# EAGLE design main_scm (EAGLE 9.2.0)
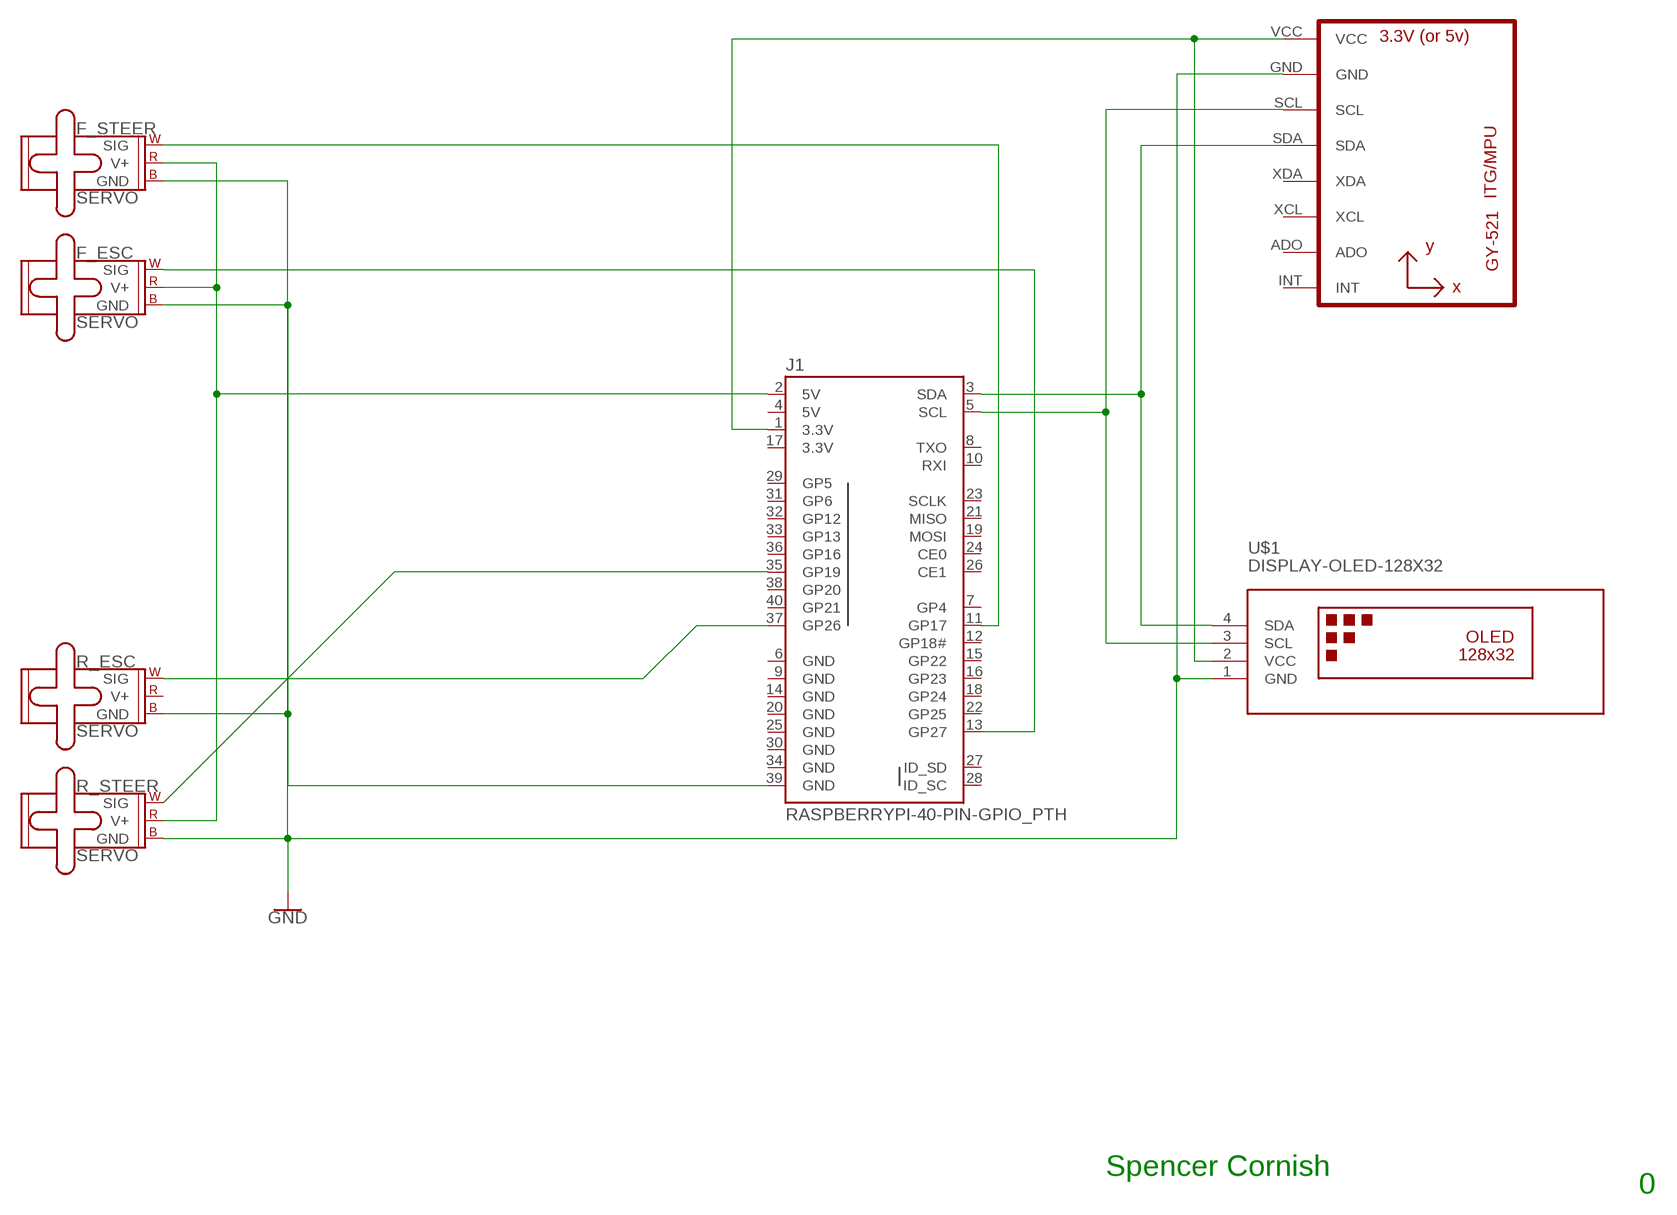
[diagram p0: schematic, sheet 1]

## Parts
F_ESC  SERVO  [1X03]
F_STEER  SERVO  [1X03]
J1  RASPBERRYPI-40-PIN-GPIO_PTH  [2X20_SHROUDED]
R_ESC  SERVO  [1X03]
R_STEER  SERVO  [1X03]
U1  GY-521MPU6050  [GY-521]
U$1  DISPLAY-OLED-128X32  [DISPLAY-OLED-128X32]

## Nets
GND: F_ESC.3(GND) F_STEER.3(GND) J1.39(GND) R_ESC.3(GND) R_STEER.3(GND) U1.GND U$1.1(GND)
N$2: J1.1(3.3V) U1.VCC U$1.2(VCC)
N$3: F_ESC.2(V+) F_STEER.2(V+) J1.2(5V) R_STEER.2(V+)
N$4: J1.3(SDA) U1.SDA U$1.4(SDA)
N$5: J1.5(SCL) U1.SCL U$1.3(SCL)
N$6: J1.35(GP19) R_STEER.1(SIG)
N$7: F_ESC.1(SIG) J1.13(GP27)
N$8: J1.37(GP26) R_ESC.1(SIG)
N$10: F_STEER.1(SIG) J1.11(GP17)
Unconnected: J1.7(GP4) J1.8(TXO) J1.10(RXI) J1.12(GP18#) J1.15(GP22) J1.16(GP23) J1.18(GP24) J1.19(MOSI) J1.21(MISO) J1.22(GP25) J1.23(SCLK) J1.24(CE0) J1.26(CE1) J1.27(ID_SD) J1.28(ID_SC) J1.29(GP5) J1.31(GP6) J1.32(GP12) J1.33(GP13) J1.36(GP16) J1.38(GP20) J1.40(GP21) R_ESC.2(V+) U1.ADO U1.INT U1.XCL U1.XDA

## Notes on the sheet
- Spencer Cornish
- 0

## Power pins joined to a net without a drawn wire
3.3V: J1.17(3.3V)
5V: J1.4(5V)
GND: J1.6(GND) J1.9(GND) J1.14(GND) J1.20(GND) J1.25(GND) J1.30(GND) J1.34(GND)

## Library data of the parts
F_ESC F_STEER R_ESC R_STEER = SparkFun-Electromechanical:SERVO: Servo Motor 3-pin connector for a standard servo motor (voltage supply, ground, and control signal.) SparkFun Products Servo - Generic (Sub-Micro Size) <https://www.sparkfun.com/products/9065> (ROB-09065) Servo - Generic High Torque Continuous Rotation (Standard Size) <https://www.sparkfun.com/products/9347> (ROB-09347) Servo - Generic High Torque (Standard Size) <https://www.sparkfun.com/products/11965> (ROB-11965)
J1 = SparkFun-Connectors:RASPBERRYPI-40-PIN-GPIO: Raspberry Pi GPIO Header 2x20 pin connector, as found on B, B+, A+ models. Both shrouded PTH and SMT versions available. SparkFun Products: GPIO Shrouded Header <https://www.sparkfun.com/products/13054>- PTH SparkFun Pi Wedge (Preassembled) <https://www.sparkfun.com/products/13717>; PROD_ID: CONN-12263; SF_ID: PRT-13054
U1 = gy-521:GY-521
U$1 = diy-modules:DISPLAY-OLED-128X32: 128x32 Dot Matrix OLED Module with I2C interface based on SSD1306 chip More details available here: http://www.tinyosshop.com/index.php?route=product/product&product_id=953 Schematic available here: http://www.tinyosshop.com/datasheet/OLED%2012832.pdf SSD1306 datasheet: https://cdn-shop.adafruit.com/datasheets/SSD1306.pdf Click here to find device on ebay.com <http://www.ebay.com/sch/oled+display+128x32+i2c>

## Board
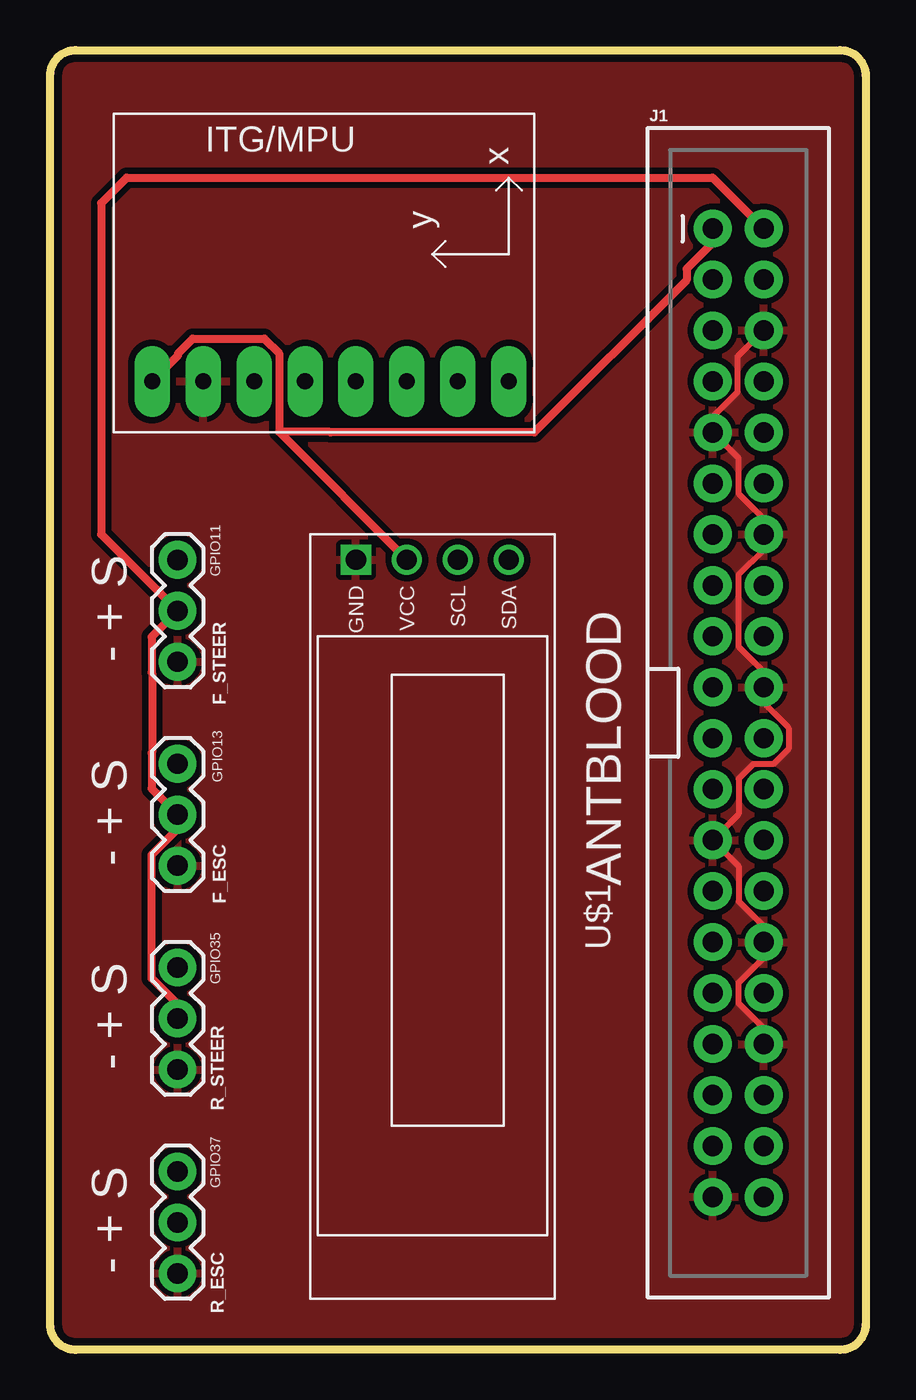
[diagram p1: board, top side]
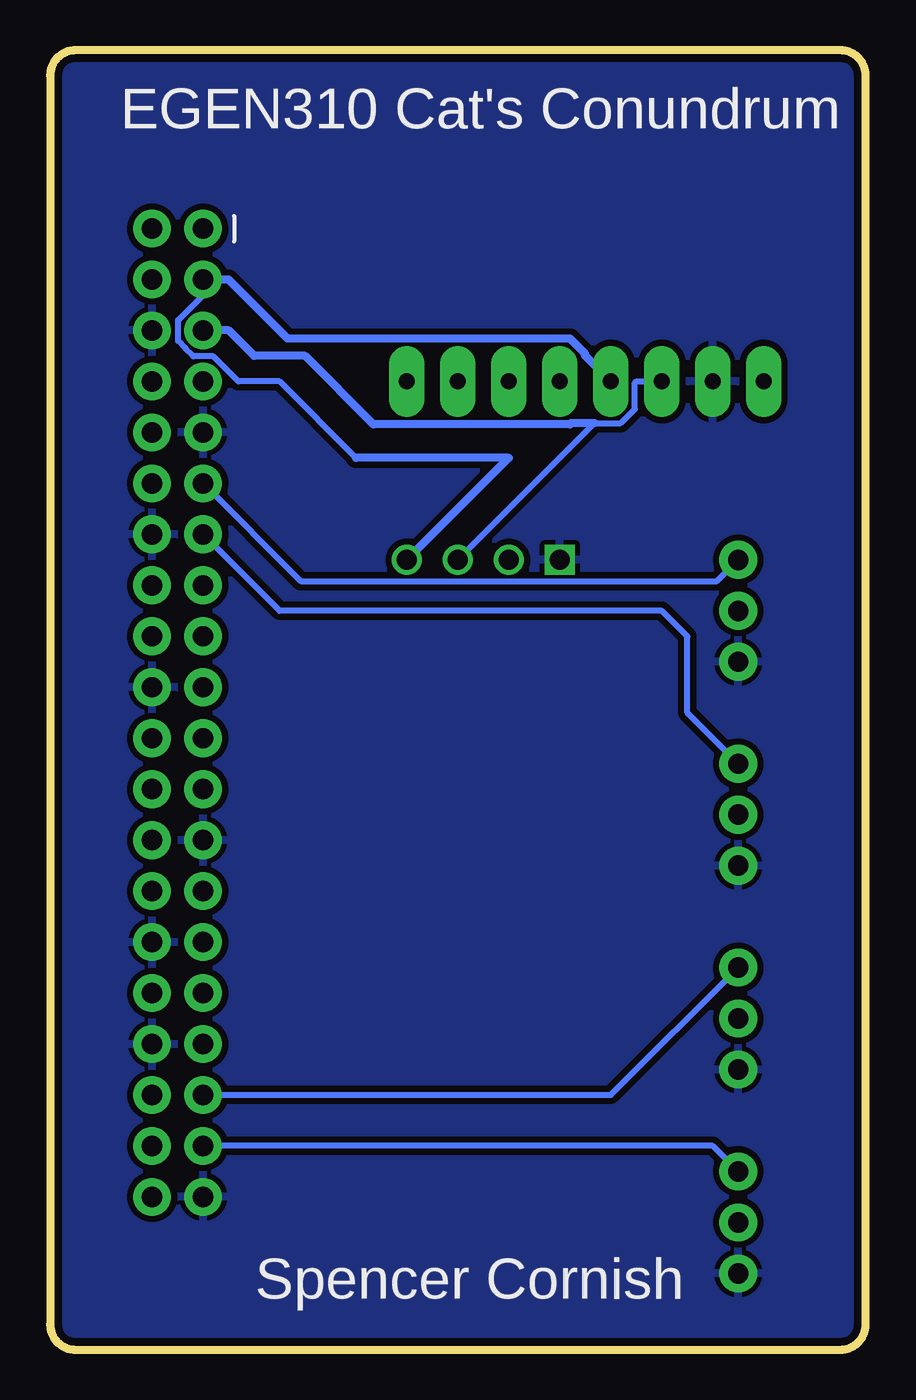
[diagram p2: board, bottom side, seen from below]

Size 40.64 x 64.77 mm. Coordinates in mm from the lower left corner, seen from the top.
Outline: 0,63.5 arc-90 1.27,64.77 39.37,64.77 arc-90 40.64,63.5 40.64,1.27 arc-90 39.37,0 1.27,0 arc-90 0,1.27 0,63.5
Copper layers (1*16): Top 0.035559375mm / dielectric 1.6mm / Bottom 0.035559375mm
Design rules "oshpark-2layer": minimum track width 6mil, minimum drill 10mil, track to track 6mil, track to pad 6mil, pad to pad 6mil, via to via 6mil, smd to smd 6mil, copper to edge 15mil, drill to drill 6mil, minimum pad ring 5mil, minimum via ring 5mil, stop-mask expansion 2.5mil, vias tented up to drill 0mil, thermal gap 10mil

### Footprints (pad centres in the part's own frame; a part is rotated, then mirrored left to right if it is on the bottom)
1X03 = drill 1.016 pad 1.88: 1 0,0; 2 2.54,0; 3 5.08,0
2X20_SHROUDED = drill 1.016 pad 1.88: 1 -1.27,24.13; 2 1.27,24.13; 3 -1.27,21.59; 4 1.27,21.59; 5 -1.27,19.05; 6 1.27,19.05; 7 -1.27,16.51; 8 1.27,16.51; 9 -1.27,13.97; 10 1.27,13.97; 11 -1.27,11.43; 12 1.27,11.43; 13 -1.27,8.89; 14 1.27,8.89; 15 -1.27,6.35; 16 1.27,6.35; 17 -1.27,3.81; 18 1.27,3.81; 19 -1.27,1.27; 20 1.27,1.27; 21 -1.27,-1.27; 22 1.27,-1.27; 23 -1.27,-3.81; 24 1.27,-3.81; 25 -1.27,-6.35; 26 1.27,-6.35; 27 -1.27,-8.89; 28 1.27,-8.89; 29 -1.27,-11.43; 30 1.27,-11.43; 31 -1.27,-13.97; 32 1.27,-13.97; 33 -1.27,-16.51; 34 1.27,-16.51; 35 -1.27,-19.05; 36 1.27,-19.05; 37 -1.27,-21.59; 38 1.27,-21.59; 39 -1.27,-24.13; 40 1.27,-24.13
GY-521 = drill 0.8 pad 1.778 long: ADO -8.89,-6.35; GND -8.89,6.35; INT -8.89,-8.89; SCL -8.89,3.81; SDA -8.89,1.27; VCC -8.89,8.89; XCL -8.89,-3.81; XDA -8.89,-1.27
DISPLAY-OLED-128X32 = drill 1 square: 1 -17.78,-3.81 | drill 1: 2 -17.78,-1.27; 3 -17.78,1.27; 4 -17.78,3.81

### Placement (x,y rotation side)
F_ESC  6.35,29.21 270 top
F_STEER  6.35,39.37 270 top
J1  34.29,31.75 0 top
R_ESC  6.35,8.89 270 top
R_STEER  6.35,19.05 270 top
U1  13.97,57.15 90 top
U$1  19.05,21.59 270 top

### Tracks (layer width: path | path; a pad name or v marks a point on that pad's centre or on a via)
GND
  Top 0.305: J1.34 35.56,16.02 34.32,17.26 34.32,18.3 35.56,19.54 J1.30 35.56,21.1 34.32,22.34 34.32,24.11 J1.25 34.32,26.7 34.32,28.46 35.04,29.19 36.02,29.19 36.8,29.96 36.8,31 35.56,32.24 J1.20 35.56,33.8 34.32,35.04 34.32,38.62 35.56,39.86 J1.14 35.56,41.42 34.32,42.66 34.32,44.42 J1.9 33.02,46.5 34.26,47.74 34.26,49.51 J1.6
  pour Bottom (isolate 0.305): 0,63.5 arc-90 1.27,64.77 39.37,64.77 arc-90 40.64,63.5 40.64,1.27 arc-90 39.37,0 1.27,0 arc-90 0,1.27
  pour Top (isolate 0.305): 0,63.5 arc-90 1.27,64.77 39.37,64.77 arc-90 40.64,63.5 40.64,1.27 arc-90 39.37,0 1.27,0 arc-90 0,1.27
  pour Bottom (isolate 0.305): 0,63.5 arc-90 1.27,64.77 39.37,64.77 arc-90 40.64,63.5 40.64,1.27 arc-90 39.37,0 1.27,0 arc-90 0,1.27
  pour Top (isolate 0.305): 0,63.5 arc-90 1.27,64.77 39.37,64.77 arc-90 40.64,63.5 40.64,1.27 arc-90 39.37,0 1.27,0 arc-90 0,1.27
  pour Top (isolate 0.305): 0,1.27 0,63.5 arc-90 1.27,64.77 39.37,64.77 arc-90 40.64,63.5 40.64,1.27 arc-90 39.37,0 1.27,0 arc-90
N$2
  Top 0.406: U1.VCC 6.38,49.56 6.38,49.67 7.1,50.39 10.68,50.39 11.41,49.67 11.41,45.75 | 11.41,45.75 U$1.2 | J1.1 33.02,55.17 31.73,53.88 31.73,53.31 24.13,45.72 13.97,45.72 13.95,45.75 11.41,45.75
N$3
  Top 0.406: J1.2 33.02,58.42 3.81,58.42 2.54,57.15 2.54,40.64 F_STEER.2 5.05,35.53 5.05,33.75 5.08,33.73 5.08,29.77 5.05,29.75 5.05,27.97 F_ESC.2 6.35,25.96 5.05,24.67 5.05,18.51 6.35,17.22 R_STEER.2
N$4
  Bottom 0.305: J1.3 33.02,52.56 34.26,51.32 34.26,50.28 33.9,49.92 33.54,49.56 33.49,49.51 32.5,49.51 31.26,48.26 29.21,48.26 25.4,44.45
  Bottom 0.406: U1.SDA 13.99,49.56 13.99,49.67 14.72,50.39 28.8,50.39 31.75,53.34 J1.3 | U$1.4 17.78,44.45 25.4,44.45
N$5
  Bottom 0.305: U1.SCL 11.43,48.26 11.51,48.18 11.51,46.88 12.21,46.18 13.51,46.18 U$1.3
  Bottom 0.406: 13.51,46.18 14.67,46.18 14.72,46.13 24.54,46.13 27.94,49.53 30.48,49.53 31.75,50.8 J1.5
N$6
  Bottom 0.305: J1.35 12.7,12.7 R_STEER.1
N$7
  Bottom 0.305: J1.13 29.21,36.83 10.16,36.83 8.89,35.56 8.89,31.75 F_ESC.1
N$8
  Bottom 0.305: R_ESC.1 7.62,10.16 J1.37
N$10
  Bottom 0.305: J1.11 28.15,38.31 7.41,38.31 F_STEER.1

### Text on the board
tPlace: GPIO11 | ANTBLOOD | - + S | GPIO13 | - + S | GPIO35 | - + S | GPIO37 | - + S
bPlace: EGEN310 Cat's Conundrum | Spencer Cornish